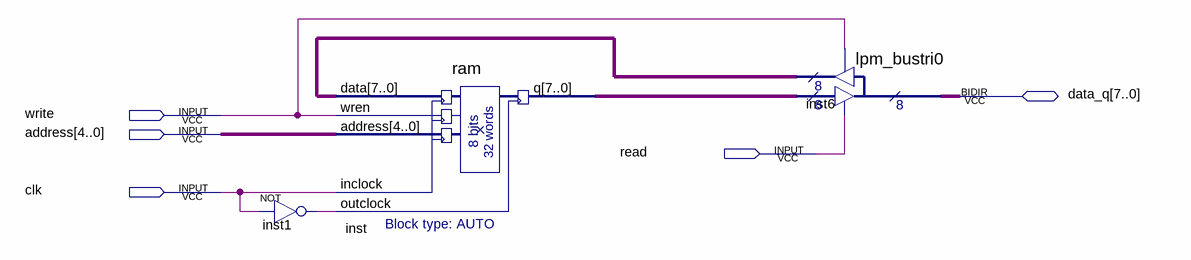
[diagram p0: schematic sheet]
// Quartus schematic ram0.bdf as structural Verilog: 3 symbols, 5 pins
module ram0 (
  input  write,
  input  [4:0] address,
  input  read,
  input  clk,
  inout  [7:0] data_q
);

  wire inst1_out;
  wire [7:0] inst6_result, inst_q;

  not inst1 (inst1_out, clk);
  ram inst (.data(inst6_result), .wren(write), .address(address), .inclock(clk), .outclock(inst1_out), .q(inst_q));
  lpm_bustri0 inst6 (.enabledt(read), .data(inst_q), .enabletr(write), .result(inst6_result), .tridata(data_q));
endmodule
